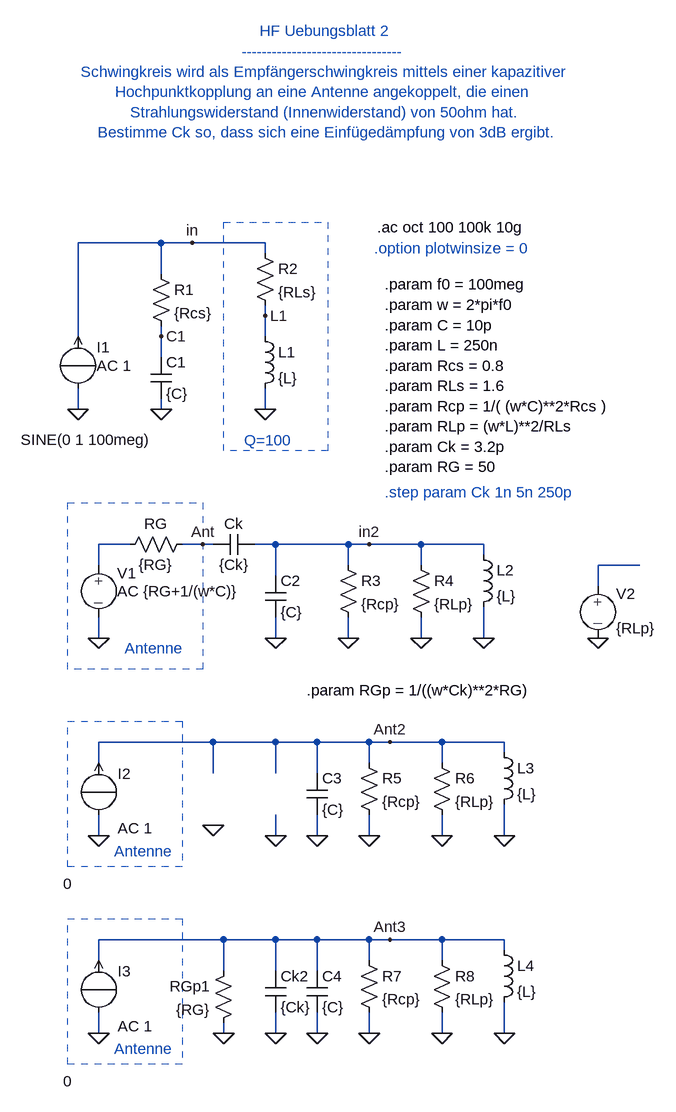
[diagram p0: schematic kapaz_hochpunkt_resonator_antenne.asc]
kapaz_hochpunkt_resonator_antenne.asc, the LTspice schematic file:
Version 4
SHEET 1 2292 1020
WIRE -848 -592 -976 -592
WIRE -800 -592 -848 -592
WIRE -688 -592 -800 -592
WIRE -688 -576 -688 -592
WIRE -848 -544 -848 -592
WIRE -688 -480 -688 -496
WIRE -976 -448 -976 -592
WIRE -848 -448 -848 -464
WIRE -688 -448 -688 -480
WIRE -848 -416 -848 -448
WIRE -976 -336 -976 -368
WIRE -848 -336 -848 -352
WIRE -688 -336 -688 -368
WIRE -896 -128 -944 -128
WIRE -784 -128 -816 -128
WIRE -768 -128 -784 -128
WIRE -672 -128 -704 -128
WIRE -560 -128 -672 -128
WIRE -528 -128 -560 -128
WIRE -448 -128 -528 -128
WIRE -352 -128 -448 -128
WIRE -352 -112 -352 -128
WIRE -944 -96 -944 -128
WIRE -560 -96 -560 -128
WIRE -448 -96 -448 -128
WIRE -112 -96 -176 -96
WIRE -672 -80 -672 -128
WIRE -176 -64 -176 -96
WIRE -944 16 -944 -16
WIRE -672 16 -672 -16
WIRE -560 16 -560 -16
WIRE -448 16 -448 -16
WIRE -352 16 -352 -32
WIRE -768 176 -944 176
WIRE -672 176 -768 176
WIRE -608 176 -672 176
WIRE -528 176 -608 176
WIRE -496 176 -528 176
WIRE -416 176 -496 176
WIRE -320 176 -416 176
WIRE -320 192 -320 176
WIRE -944 208 -944 176
WIRE -528 208 -528 176
WIRE -416 208 -416 176
WIRE -768 224 -768 176
WIRE -672 224 -672 176
WIRE -608 224 -608 176
WIRE -944 320 -944 288
WIRE -672 320 -672 288
WIRE -608 320 -608 288
WIRE -528 320 -528 288
WIRE -416 320 -416 288
WIRE -320 320 -320 272
WIRE -752 480 -944 480
WIRE -672 480 -752 480
WIRE -608 480 -672 480
WIRE -528 480 -608 480
WIRE -496 480 -528 480
WIRE -416 480 -496 480
WIRE -320 480 -416 480
WIRE -320 496 -320 480
WIRE -944 512 -944 480
WIRE -528 512 -528 480
WIRE -416 512 -416 480
WIRE -752 528 -752 480
WIRE -672 528 -672 480
WIRE -608 528 -608 480
WIRE -944 624 -944 592
WIRE -752 624 -752 608
WIRE -672 624 -672 592
WIRE -608 624 -608 592
WIRE -528 624 -528 592
WIRE -416 624 -416 592
WIRE -320 624 -320 576
FLAG -976 -336 0
FLAG -848 -336 0
FLAG -688 -336 0
FLAG -848 -448 C1
FLAG -688 -480 L1
FLAG -800 -592 in
FLAG -352 16 0
FLAG -528 -128 in2
FLAG -448 16 0
FLAG -560 16 0
FLAG -672 16 0
FLAG -944 16 0
FLAG -784 -128 Ant
FLAG -320 320 0
FLAG -496 176 Ant2
FLAG -416 320 0
FLAG -528 320 0
FLAG -608 320 0
FLAG -944 320 0
FLAG -672 320 0
FLAG -176 16 0
FLAG -768 304 0
FLAG -320 624 0
FLAG -496 480 Ant3
FLAG -416 624 0
FLAG -528 624 0
FLAG -608 624 0
FLAG -944 624 0
FLAG -672 624 0
FLAG -752 624 0
SYMBOL res -864 -560 R0
SYMATTR InstName R1
SYMATTR Value {Rcs}
SYMBOL ind -704 -464 R0
SYMATTR InstName L1
SYMATTR Value {L}
SYMBOL cap -864 -416 R0
SYMATTR InstName C1
SYMATTR Value {C}
SYMBOL source-I -976 -448 R0
WINDOW 123 29 45 Left 2
WINDOW 39 0 0 Left 2
WINDOW 3 -88 159 Left 2
SYMATTR Value2 AC 1
SYMATTR InstName I1
SYMATTR Value SINE(0 1 100meg)
SYMBOL res -704 -592 R0
SYMATTR InstName R2
SYMATTR Value {RLs}
SYMBOL source-V -944 -112 R0
WINDOW 123 28 56 Left 2
WINDOW 39 0 0 Left 2
SYMATTR InstName V1
SYMATTR Value ""
SYMATTR Value2 AC {RG+1/(w*C)}
SYMBOL res -912 -112 R270
WINDOW 0 32 56 VTop 2
WINDOW 3 0 56 VBottom 2
SYMATTR InstName RG
SYMATTR Value {RG}
SYMBOL cap -704 -144 R90
WINDOW 0 0 32 VBottom 2
WINDOW 3 32 32 VTop 2
SYMATTR InstName Ck
SYMATTR Value {Ck}
SYMBOL cap -688 -80 R0
SYMATTR InstName C2
SYMATTR Value {C}
SYMBOL res -576 -112 R0
SYMATTR InstName R3
SYMATTR Value {Rcp}
SYMBOL res -464 -112 R0
SYMATTR InstName R4
SYMATTR Value {RLp}
SYMBOL ind -368 -128 R0
SYMATTR InstName L2
SYMATTR Value {L}
SYMBOL cap -624 224 R0
SYMATTR InstName C3
SYMATTR Value {C}
SYMBOL res -544 192 R0
SYMATTR InstName R5
SYMATTR Value {Rcp}
SYMBOL res -432 192 R0
SYMATTR InstName R6
SYMATTR Value {RLp}
SYMBOL ind -336 176 R0
SYMATTR InstName L3
SYMATTR Value {L}
SYMBOL source-I -944 208 R0
WINDOW 123 29 101 Left 2
WINDOW 39 0 0 Left 2
WINDOW 3 -55 186 Left 2
SYMATTR Value2 AC 1
SYMATTR InstName I2
SYMATTR Value 0
SYMBOL source-V -176 -80 R0
WINDOW 123 28 56 Left 2
WINDOW 39 0 0 Left 2
SYMATTR InstName V2
SYMATTR Value {RLp}
SYMBOL res -736 512 M0
SYMATTR InstName RGp1
SYMATTR Value {RG}
SYMBOL cap -688 528 R0
SYMATTR InstName Ck2
SYMATTR Value {Ck}
SYMBOL cap -624 528 R0
SYMATTR InstName C4
SYMATTR Value {C}
SYMBOL res -544 496 R0
SYMATTR InstName R7
SYMATTR Value {Rcp}
SYMBOL res -432 496 R0
SYMATTR InstName R8
SYMATTR Value {RLp}
SYMBOL ind -336 480 R0
SYMATTR InstName L4
SYMATTR Value {L}
SYMBOL source-I -944 512 R0
WINDOW 123 29 101 Left 2
WINDOW 39 0 0 Left 2
WINDOW 3 -55 186 Left 2
SYMATTR Value2 AC 1
SYMATTR InstName I3
SYMATTR Value 0
TEXT -516 -616 Left 2 !.ac oct 100 100k 10g
TEXT -720 -288 Left 2 ;Q=100
TEXT -520 -584 Left 2 ;.option plotwinsize = 0
TEXT -592 -840 Center 2 ;HF Uebungsblatt 2 \n--------------------------------\nSchwingkreis wird als Empfängerschwingkreis mittels einer kapazitiver \nHochpunktkopplung an eine Antenne angekoppelt, die einen \nStrahlungswiderstand (Innenwiderstand) von 50ohm hat.\nBestimme Ck so, dass sich eine Einfügedämpfung von 3dB ergibt.
TEXT -904 32 Left 2 ;Antenne
TEXT -504 -528 Left 2 !.param f0 = 100meg\n.param w = 2*pi*f0\n.param C = 10p\n.param L = 250n\n.param Rcs = 0.8\n.param RLs = 1.6\n.param Rcp = 1/( (w*C)**2*Rcs )\n.param RLp = (w*L)**2/RLs \n.param Ck = 3.2p\n.param RG = 50
TEXT -504 -208 Left 2 ;.step param Ck 1n 5n 250p
TEXT -920 344 Left 2 ;Antenne
TEXT -624 96 Left 2 !.param RGp = 1/((w*Ck)**2*RG)
TEXT -920 648 Left 2 ;Antenne
RECTANGLE Normal -592 -272 -752 -624 2
RECTANGLE Normal -784 64 -992 -192 2
RECTANGLE Normal -816 368 -992 144 2
RECTANGLE Normal -816 672 -992 448 2

The netlist it stands for:
* kapaz_hochpunkt_resonator_antenne.asc
R1 in C1 {Rcs}
L1 L1 0 {L}
C1 C1 0 {C}
I1 0 in SINE(0 1 100meg) AC 1
R2 in L1 {RLs}
V1 N001 0 AC {RG+1/(w*C)}
RG N001 Ant {RG}
Ck in2 Ant {Ck}
C2 in2 0 {C}
R3 in2 0 {Rcp}
R4 in2 0 {RLp}
L2 in2 0 {L}
C3 Ant2 0 {C}
R5 Ant2 0 {Rcp}
R6 Ant2 0 {RLp}
L3 Ant2 0 {L}
I2 0 Ant2 0 AC 1
V2 N002 0 {RLp}
RGp1 Ant3 0 {RG}
Ck2 Ant3 0 {Ck}
C4 Ant3 0 {C}
R7 Ant3 0 {Rcp}
R8 Ant3 0 {RLp}
L4 Ant3 0 {L}
I3 0 Ant3 0 AC 1
.ac oct 100 100k 10g
* Q=100
* .option plotwinsize = 0
* HF Uebungsblatt 2
* --------------------------------
* Schwingkreis wird als Empfängerschwingkreis mittels einer kapazitiver
* Hochpunktkopplung an eine Antenne angekoppelt, die einen
* Strahlungswiderstand (Innenwiderstand) von 50ohm hat.
* Bestimme Ck so, dass sich eine Einfügedämpfung von 3dB ergibt.
* Antenne
.param f0 = 100meg
.param w = 2*pi*f0
.param C = 10p
.param L = 250n
.param Rcs = 0.8
.param RLs = 1.6
.param Rcp = 1/( (w*C)**2*Rcs )
.param RLp = (w*L)**2/RLs
.param Ck = 3.2p
.param RG = 50
* .step param Ck 1n 5n 250p
* Antenne
.param RGp = 1/((w*Ck)**2*RG)
* Antenne
.backanno
.end